# EAGLE schematic co2-monitor (EAGLE 7.5.0)
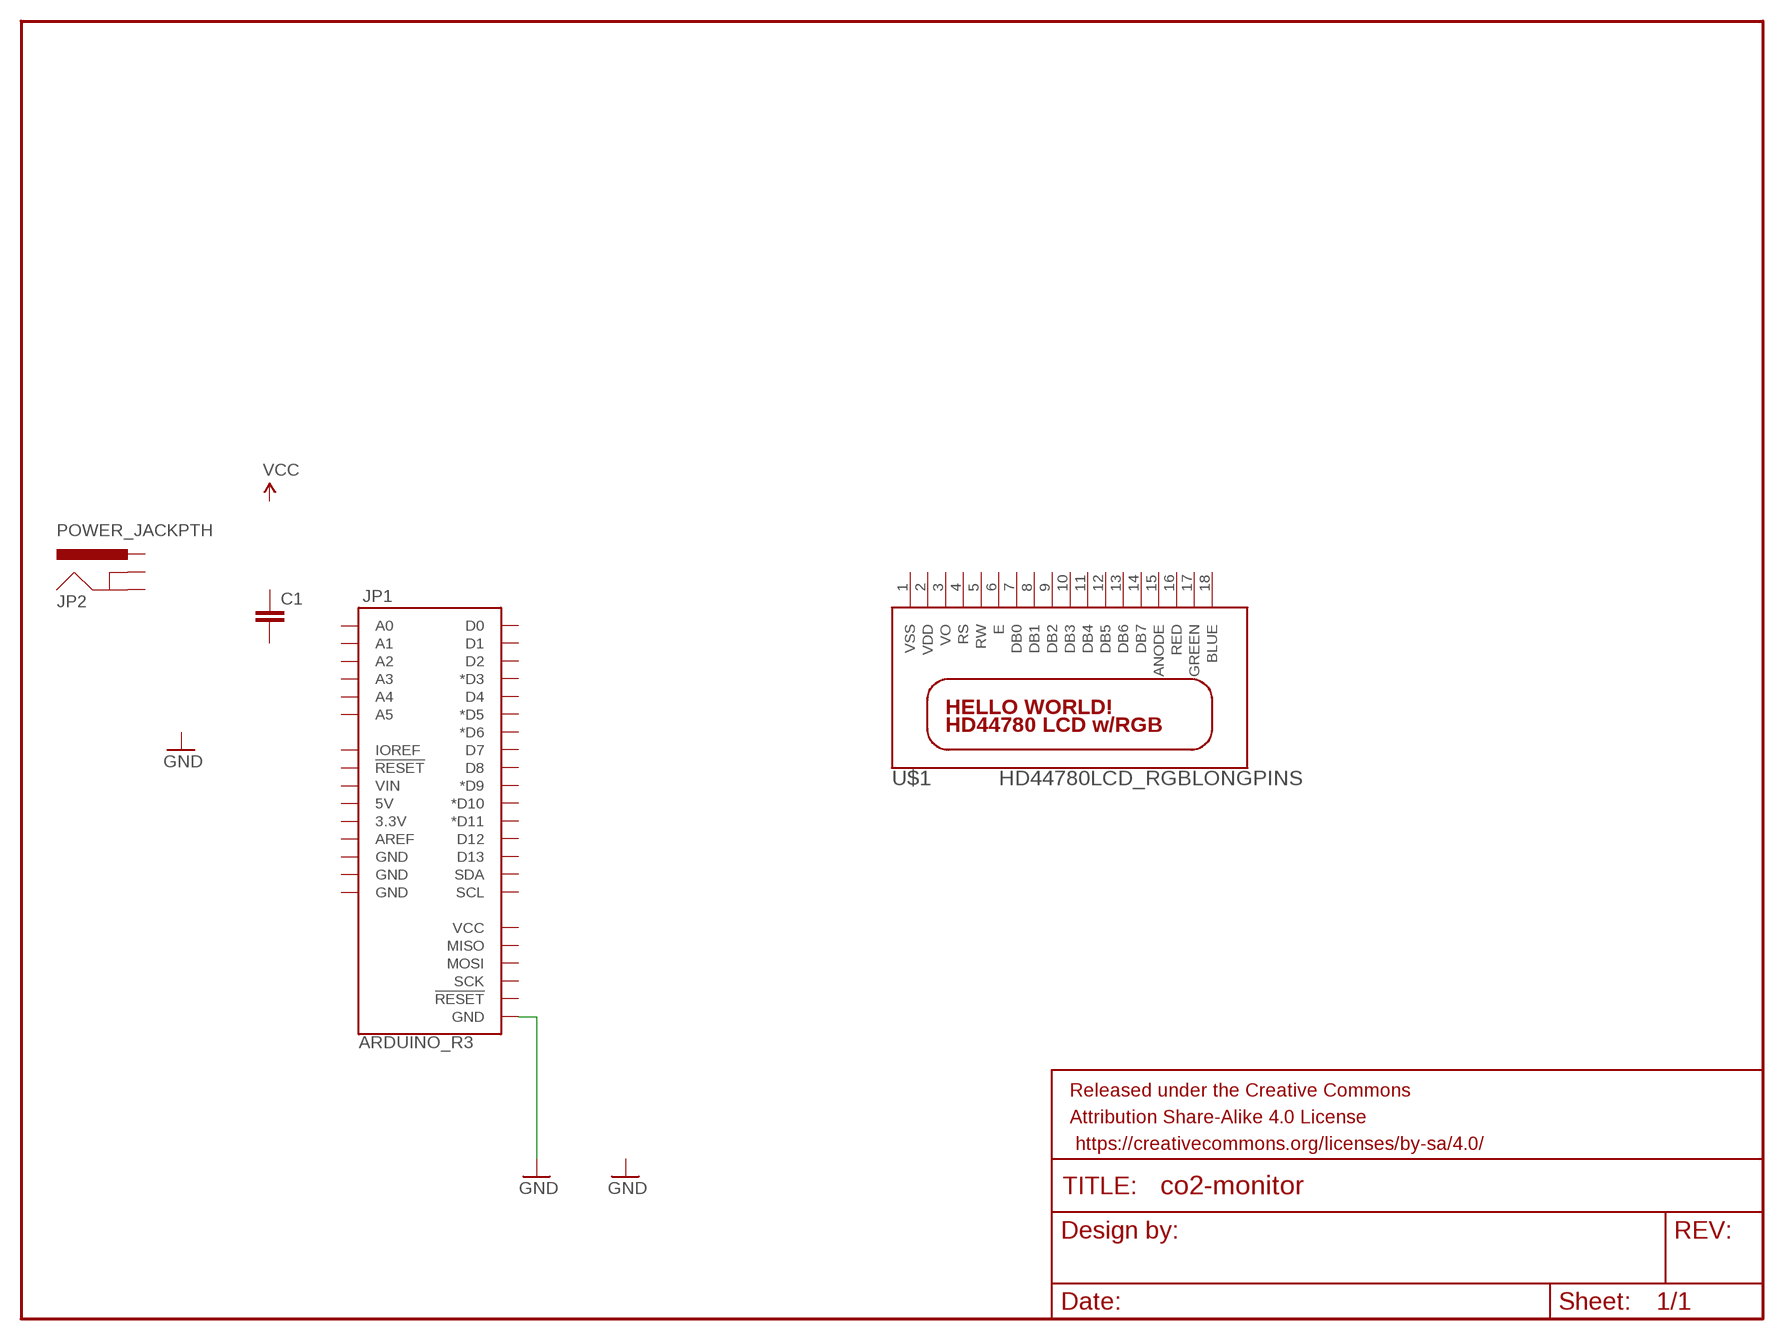
[diagram p0: schematic, sheet 1]

## Parts
C1  0.1UF-50V-20%(PTH)KIT-EZ  [CAP-PTH-SMALL-KIT]
FRAME1  FRAME-LETTERNO_PACKAGE  [DUMMY]
JP1  ARDUINO_R3  [ARDUINO_R3]
JP2  POWER_JACKPTH  [POWER_JACK_PTH]
U$1  HD44780LCD_RGBLONGPINS  [LCD1602-RGB]

## Nets
GND: JP1.GND@1(GND)
Unconnected: C1.1 C1.2 JP1.3.3V JP1.5V JP1.A0 JP1.A1 JP1.A2 JP1.A3 JP1.A4 JP1.A5 JP1.AREF JP1.D0 JP1.D1 JP1.D2 JP1.D3(*D3) JP1.D4 JP1.D5(*D5) JP1.D6(*D6) JP1.D7 JP1.D8 JP1.D9(*D9) JP1.D10(*D10) JP1.D11(*D11) JP1.D12 JP1.D13 JP1.GND@2(GND) JP1.GND@3(GND) JP1.GND@4(GND) JP1.IOREF JP1.MISO JP1.MOSI JP1.RESET@1(!RESET!) JP1.RESET@2(!RESET!) JP1.SCK JP1.SCL JP1.SDA JP1.VCC JP1.VIN JP2.GND JP2.GNDBREAK JP2.PWR U$1.1(VSS) U$1.2(VDD) U$1.3(VO) U$1.4(RS) U$1.5(RW) U$1.6(E) U$1.7(DB0) U$1.8(DB1) U$1.9(DB2) U$1.10(DB3) U$1.11(DB4) U$1.12(DB5) U$1.13(DB6) U$1.14(DB7) U$1.15(ANODE) U$1.16(RED) U$1.17(GREEN) U$1.18(BLUE)

## Library data of the parts
C1 = SparkFun-Capacitors:0.1UF-50V-20%(PTH): CAP-08370; PROD_ID: CAP-08370
FRAME1 = SparkFun-Aesthetics:FRAME-LETTER: Schematic Frame Standard 8.5x11 US Letter frame; DESIGNER: Nobody; VERSION: v01
JP1 = SparkFun-Boards:ARDUINO_R3: Arduino R3 Footprint (w/ SPI header)
JP2 = SparkFun-Connectors:POWER_JACK: Power Jack This is the standard 5.5mm barrel jack for power. The PTH is the most common, proven, reliable, footprint. The Slot footprint only works if the mill layer is transmitted to the PCB fab house so be warned. Mating wall wart : TOL-00298 (and others); PROD_ID: CONN-08197
U$1 = adafruit:HD44780LCD_RGB